# Altium schematic sheet Sheet5.SchDoc
size A3
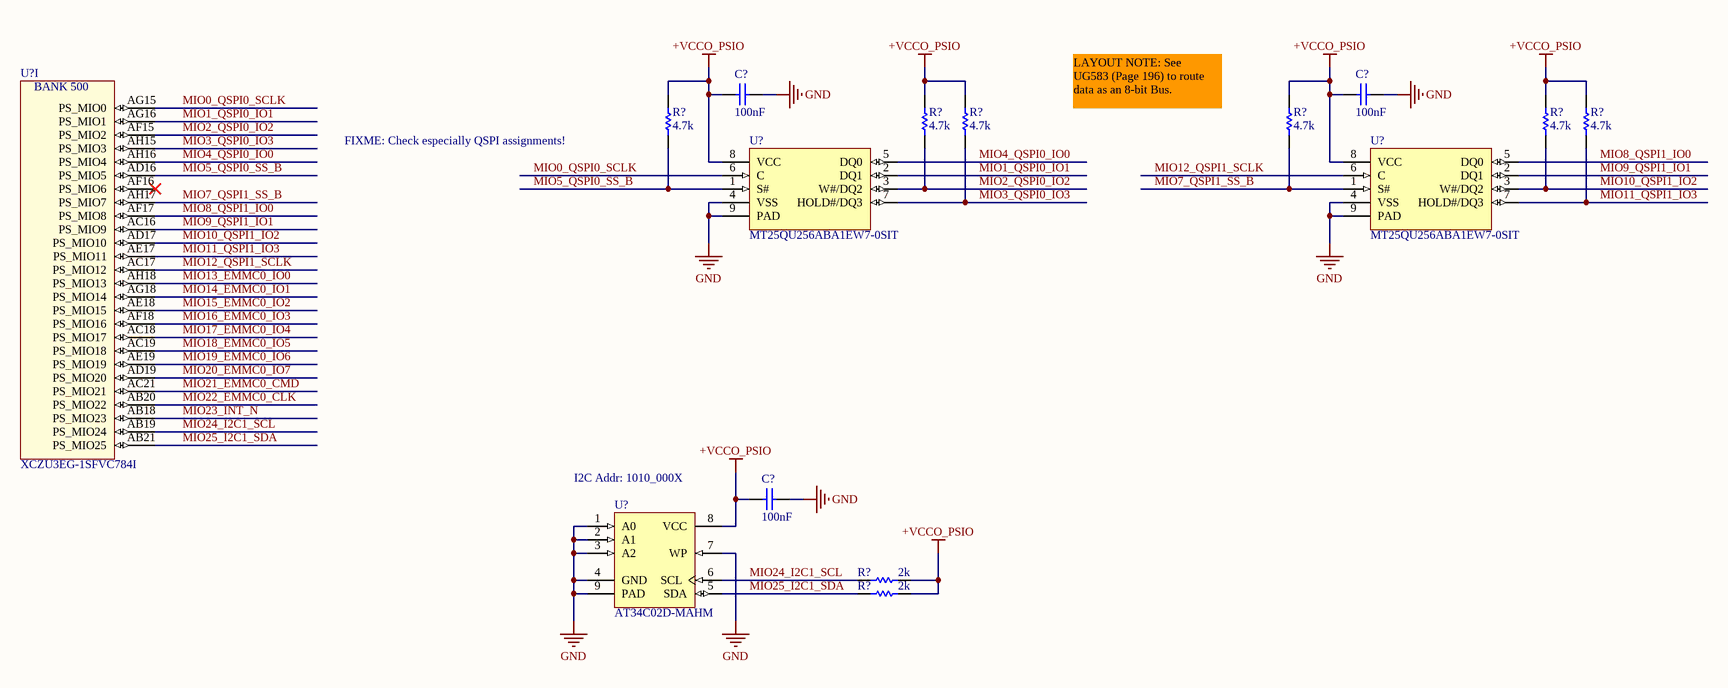
[diagram p0: Sheet5.SchDoc]

## Parts
(Parts that share a designator on the sheet are numbered #1, #2 ... from top to bottom, then left to right.)
C?#1  100nF  [CAPC1005L_0402]
C?#2  100nF  [CAPC1005L_0402]
C?#3  100nF  [CAPC1005L_0402]
R?#1  value 4.7k  [RESC1005L_0402]  (hidden comment: RES0402_4K7_0W1_1T)
R?#2  value 4.7k  [RESC1005L_0402]  (hidden comment: RES0402_4K7_0W1_1T)
R?#3  value 4.7k  [RESC1005L_0402]  (hidden comment: RES0402_4K7_0W1_1T)
R?#4  value 4.7k  [RESC1005L_0402]  (hidden comment: RES0402_4K7_0W1_1T)
R?#5  value 4.7k  [RESC1005L_0402]  (hidden comment: RES0402_4K7_0W1_1T)
R?#6  value 4.7k  [RESC1005L_0402]  (hidden comment: RES0402_4K7_0W1_1T)
R?#7  value 2k  [RESC1005L_0402]  (hidden comment: RES0402_2K_0W1_1T)
R?#8  value 2k  [RESC1005L_0402]  (hidden comment: RES0402_2K_0W1_1T)
U?#1  XCZU3EG-1SFVC784I  [BGA784x28]  (part I of 22)
U?#2  MT25QU256ABA1EW7-0SIT  [W-PDFN-8_6x5mm]
U?#3  MT25QU256ABA1EW7-0SIT  [W-PDFN-8_6x5mm]
U?#4  AT34C02D-MAHM  [UDFN_9]

## Nets
+VCCO_PSIO: C?#1.1 C?#2.1 C?#3.1 R?#1.1 R?#2.1 R?#3.1 R?#4.1 R?#5.1 R?#6.1 R?#7.2 R?#8.2 U?#2.8(VCC) U?#3.8(VCC) U?#4.8(VCC)
GND: C?#1.2 C?#2.2 C?#3.2 U?#2.4(VSS) U?#2.9(PAD) U?#3.4(VSS) U?#3.9(PAD) U?#4.1(A0) U?#4.2(A1) U?#4.3(A2) U?#4.4(GND) U?#4.7(WP) U?#4.9(PAD)
MIO0_QSPI0_SCLK: U?#1.AG15(PS_MIO0) U?#2.6(C)
MIO1_QSPI0_IO1: U?#1.AG16(PS_MIO1) U?#2.2(DQ1)
MIO2_QSPI0_IO2: R?#2.2 U?#1.AF15(PS_MIO2) U?#2.3(W#/DQ2)
MIO3_QSPI0_IO3: R?#3.2 U?#1.AH15(PS_MIO3) U?#2.7(HOLD#/DQ3)
MIO4_QSPI0_IO0: U?#1.AH16(PS_MIO4) U?#2.5(DQ0)
MIO5_QSPI0_SS_B: R?#1.2 U?#1.AD16(PS_MIO5) U?#2.1(S#)
MIO7_QSPI1_SS_B: R?#4.2 U?#1.AH17(PS_MIO7) U?#3.1(S#)
MIO8_QSPI1_IO0: U?#1.AF17(PS_MIO8) U?#3.5(DQ0)
MIO9_QSPI1_IO1: U?#1.AC16(PS_MIO9) U?#3.2(DQ1)
MIO10_QSPI1_IO2: R?#5.2 U?#1.AD17(PS_MIO10) U?#3.3(W#/DQ2)
MIO11_QSPI1_IO3: R?#6.2 U?#1.AE17(PS_MIO11) U?#3.7(HOLD#/DQ3)
MIO12_QSPI1_SCLK: U?#1.AC17(PS_MIO12) U?#3.6(C)
MIO13_EMMC0_IO0: U?#1.AH18(PS_MIO13)
MIO14_EMMC0_IO1: U?#1.AG18(PS_MIO14)
MIO15_EMMC0_IO2: U?#1.AE18(PS_MIO15)
MIO16_EMMC0_IO3: U?#1.AF18(PS_MIO16)
MIO17_EMMC0_IO4: U?#1.AC18(PS_MIO17)
MIO18_EMMC0_IO5: U?#1.AC19(PS_MIO18)
MIO19_EMMC0_IO6: U?#1.AE19(PS_MIO19)
MIO20_EMMC0_IO7: U?#1.AD19(PS_MIO20)
MIO21_EMMC0_CMD: U?#1.AC21(PS_MIO21)
MIO22_EMMC0_CLK: U?#1.AB20(PS_MIO22)
MIO23_INT_N: U?#1.AB18(PS_MIO23)
MIO24_I2C1_SCL: R?#7.1 U?#1.AB19(PS_MIO24) U?#4.6(SCL)
MIO25_I2C1_SDA: R?#8.1 U?#1.AB21(PS_MIO25) U?#4.5(SDA)

Not connected (* = marked no-connect by the designer): U?#1 AF16(PS_MIO6)*

## Notes on the sheet
- FIXME: Check especially QSPI assignments!
- LAYOUT NOTE: See
  UG583 (Page 196) to route
  data as an 8-bit Bus.
- (near U?#4) I2C Addr: 1010_000X
- (in symbol XCZU3EG-1SFVC784I, part I) BANK 500

## Library data of the parts
C?#1-C?#3 = CAPCER0402X7R100N25V_10T: CAP CER 0.1UF 25V X7R 0402; Manufacturer 1: Murata Electronics North America; Manufacturer Part Number 1: GRM155R71E104KE14D; Tolerance: 10%; Package: 0402; ComponentLink1Description: Datasheet; Value: 100nF; Voltage: 25V; Temperature Coefficient: X7R; Supplier 1: Digi-Key; Supplier Part Number 1: 490-10698-1-ND; Operating Temperature: -55°C ~ 125°C
R?#1-R?#6 = RES0402_4K7_0W1_1T: RES SMD 4.7K OHM 1% 1/10W 0402; Manufacturer 1: Panasonic Electronic Components; Manufacturer Part Number 1: ERJ-2RKF4701X; Package: 0402; ComponentLink1Description: Datasheet; Power: 1/10W; Tolerance: 1%; Supplier 1: Digi-Key; Supplier Part Number 1: P4.70KLCT-ND
R?#7 R?#8 = RES0402_2K_0W1_1T: RES SMD 2K OHM 1% 1/16W 0402; Manufacturer 1: Vishay Dale; Manufacturer Part Number 1: CRCW04022K00FKED; Power: 1/10W; Package: 0402; ComponentLink1Description: Datasheet; Tolerance: 1%; Supplier 1: Digi-Key; Supplier Part Number 1: 541-2.00KLCT-ND
U?#1 = XCZU3EG-1SFVC784I: IC FPGA 252 I/O 784FCBGA - XILINX ZYNQ ULTRASCALE+; Manufacturer 1: Xilinx Inc.; Package: SFVC784; ComponentLink1Description: Datasheet; Supplier 1: Digi-Key; Supplier Part Number 1: XCZU3EG-1SFVC784I-ND; Manufacturer Part Number 1: XCZU3EG-1SFVC784I
U?#2 U?#3 = MT25QU256ABA1EW7-0SIT: IC FLASH 256MBIT 108MHZ 8VPDFN; Manufacturer 1: Micron Technology Inc.; ComponentLink1Description: Datasheet; ComponentLink1URL: C:\Users\Public\Documents\Altium\AD16\Library\PDF\MT25Q_QLJS_U_256_ABA_0.pdf; Supplier 1: Digi-Key; Manufacturer Part Number 1: MT25QU256ABA1EW7-0SIT
U?#4 = AT34C02D-MAHM: IC EEPROM 2KBIT 1MHZ 8UDFN; Manufacturer 1: Microchip Technology; Manufacturer Part Number 1: AT34C02D-MAHM-T; Code_JEDEC: MS-012-AA; Code_IPC: SOIC127P600-8; ComponentLink1Description: Datasheet; ComponentLink1URL: C:\Users\Public\Documents\Altium\AD16\Library\PDF\Atmel-8781-SEEPROM-AT34C02D-Datasheet.pdf; Supplier 1: Digikey; Supplier Part Number 1: AT34C02D-MAHM-TTR-ND; Operating Temperature: -40°C ~ 85°C (TA)